# Altium schematic sheet v1.1.SchDoc
size 111 x 50 mm
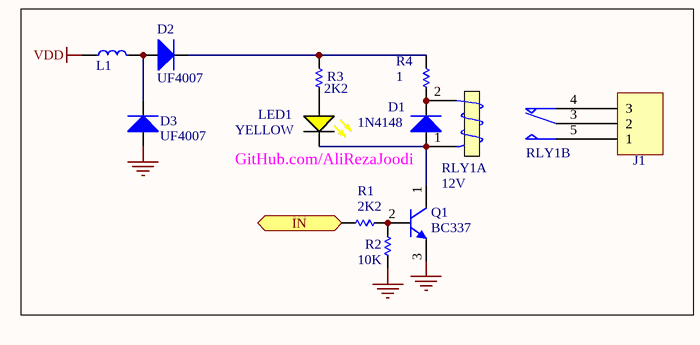
[diagram p0: v1.1.SchDoc]

## Parts
D1  1N4148  [DIODE0.4_Glass]
D2  UF4007  [D_THD_AXIAL0.4_DO-41]
D3  UF4007  [D_THD_AXIAL0.4_DO-41]
J1  3PIN  [Fonics_3PIN_1]  (value not drawn)
L1  (no value)
LED1  YELLOW  [LED_THD_3MM_YELLOW_R]
Q1  BC337  [TO92C]
R1  2K2  [R_THD_AXIAL0.4(1/4W)]
R2  10K  [R_THD_AXIAL0.4(1/4W)]
R3  2K2  [R_THD_AXIAL0.4(1/4W)]
R4  1  [R_THD_AXIAL0.4(1/4W)]
RLY1  12V  [RELAY_SPDT_5PIN_2216]  (parts A,B of 2)

## Ports
IN (in)

## Nets
GND: D3.1(A) Q1.3(E) R2.1
VDD: L1.1
IN: R1.2 ; port IN
NetD1_1: D1.1(A) LED1.2(K) Q1.1(C) RLY1.1(T2)
NetD1_2: D1.2(K) R4.1 RLY1.2(T1)
NetD2_1: D2.1(A) D3.2(K) L1.2
NetD2_2: D2.2(K) R3.2 R4.2
NetJ1_1: J1.1 RLY1.5(NO)
NetJ1_2: J1.2 RLY1.3(COM)
NetJ1_3: J1.3 RLY1.4(NC)
NetLED1_1: LED1.1(A) R3.1
NetQ1_2: Q1.2(B) R1.1 R2.2

## Notes on the sheet
- GitHub.com/AliRezaJoodi

## Library data of the parts
D1 = Diode: Default Diode; Manufacturer: Generic Components; Class I: Discrete; Class II: Diode - Switching; Published: 8-Jun-2000; Revision: July-2002: Re-released for DXP Platform.; Publisher: Altium Limited
D2 D3 = Diode: Diode,; Revision: July-2002: Re-released for DXP Platform.
J1 = Header 3: Header, 3-Pin; Manufacturer: Generic Components; Class I: Connector; Revision: July-2002: Re-released for DXP Platform.; Publisher: Altium Limited
L1 = Inductor_2Type: Inductor,
LED1 = LED_YELLOW: LED, Yellow; Manufacturer: Generic Components; Class I: Optoelectronic; Published: 8-Jun-2000; Revision: July-2002: Re-released for DXP Platform.; Publisher: Altium Limited; Class II: LED
Q1 = NPN: NPN Bipolar Transistor; Manufacturer: Generic Components; Class I: Discrete; Class II: BJT - Low Power; Published: 8-Jun-2000; Revision: July-2002: Re-released for DXP Platform.; Publisher: Altium Limited
R1-R4 = Resistor: Revision: July-2002: Re-released for DXP Platform.
RLY1 = Relay_SPDT_2Form: SPDT Relay